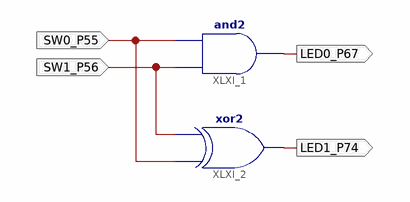
[diagram p0: schematic sheet 1]
// Xilinx ISE schematic Test.sch (spartan6) as structural Verilog: 2 symbols, 4 ports
module Test (
  input  SW0_P55,
  input  SW1_P56,
  output LED0_P67,
  output LED1_P74
);

  and XLXI_1 (LED0_P67, SW1_P56, SW0_P55);
  xor XLXI_2 (LED1_P74, SW0_P55, SW1_P56);
endmodule
